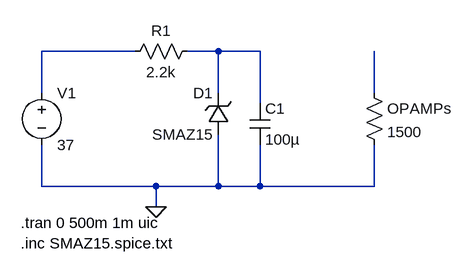
[diagram p0: schematic LowVoltageSupplyZenerApproach.asc]
LowVoltageSupplyZenerApproach.asc, the LTspice schematic file:
Version 4
SHEET 1 880 680
WIRE 208 80 64 80
WIRE 336 80 288 80
WIRE 400 80 336 80
WIRE 64 144 64 80
WIRE 336 144 336 80
WIRE 576 144 576 80
WIRE 400 160 400 80
WIRE 64 288 64 224
WIRE 240 288 64 288
WIRE 336 288 336 208
WIRE 336 288 240 288
WIRE 400 288 400 224
WIRE 400 288 336 288
WIRE 576 288 576 224
WIRE 576 288 400 288
WIRE 240 320 240 288
FLAG 240 320 0
SYMBOL voltage 64 128 R0
WINDOW 123 0 0 Left 0
WINDOW 39 0 0 Left 0
SYMATTR InstName V1
SYMATTR Value 37
SYMBOL res 304 64 R90
WINDOW 0 0 56 VBottom 2
WINDOW 3 32 56 VTop 2
SYMATTR InstName R1
SYMATTR Value 2.2k
SYMBOL cap 384 160 R0
SYMATTR InstName C1
SYMATTR Value 100µ
SYMBOL zener 352 208 R180
WINDOW 0 24 64 Left 2
WINDOW 3 24 0 Left 2
SYMATTR InstName D1
SYMATTR Value SMAZ15
SYMATTR Prefix X
SYMBOL res 560 128 R0
SYMATTR InstName OPAMPs
SYMATTR Value 1500
TEXT 32 344 Left 2 !.tran 0 500m 1m uic
TEXT 32 376 Left 2 !.inc SMAZ15.spice.txt

The netlist it stands for:
* LowVoltageSupplyZenerApproach.asc
V1 N001 0 37
R1 N002 N001 2.2k
C1 N002 0 100µ
XD1 0 N002 SMAZ15  ; pins + -
R§OPAMPs N003 0 1500
.tran 0 500m 1m uic
.inc SMAZ15.spice.txt
.backanno
.end